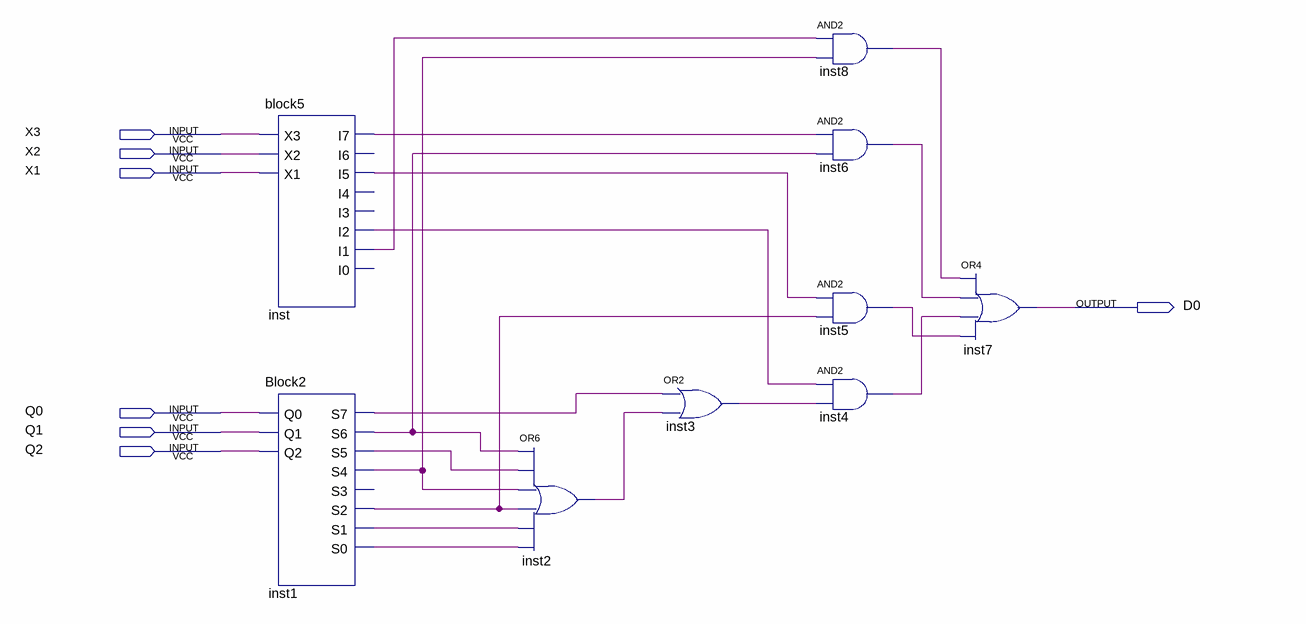
[diagram p0: schematic sheet]
// Quartus schematic block8.bdf as structural Verilog: 9 symbols, 7 pins
module block8 (
  input  X3,
  input  X2,
  input  X1,
  input  Q0,
  input  Q1,
  input  Q2,
  output D0
);

  wire inst1_s0, inst1_s1, inst1_s2, inst1_s4, inst1_s5, inst1_s6, inst1_s7, inst2_out, inst3_out, inst4_out,
       inst5_out, inst6_out, inst8_out, inst_i1, inst_i2, inst_i5, inst_i7;

  block5 inst (
    .X3(X3), .X2(X2), .X1(X1), .I7(inst_i7), .I5(inst_i5), .I2(inst_i2), .I1(inst_i1));  // open: I6, I4, I3, I0
  Block2 inst1 (
    .Q0(Q0), .Q1(Q1), .Q2(Q2), .S7(inst1_s7), .S6(inst1_s6), .S5(inst1_s5), .S4(inst1_s4), .S2(inst1_s2),
    .S1(inst1_s1), .S0(inst1_s0));  // open: S3
  or inst2 (inst2_out, inst1_s6, inst1_s5, inst1_s4, inst1_s2, inst1_s1, inst1_s0);
  or inst3 (inst3_out, inst1_s7, inst2_out);
  and inst8 (inst8_out, inst_i1, inst1_s4);
  and inst6 (inst6_out, inst_i7, inst1_s6);
  and inst5 (inst5_out, inst_i5, inst1_s2);
  and inst4 (inst4_out, inst_i2, inst3_out);
  or inst7 (D0, inst8_out, inst6_out, inst4_out, inst5_out);
endmodule
